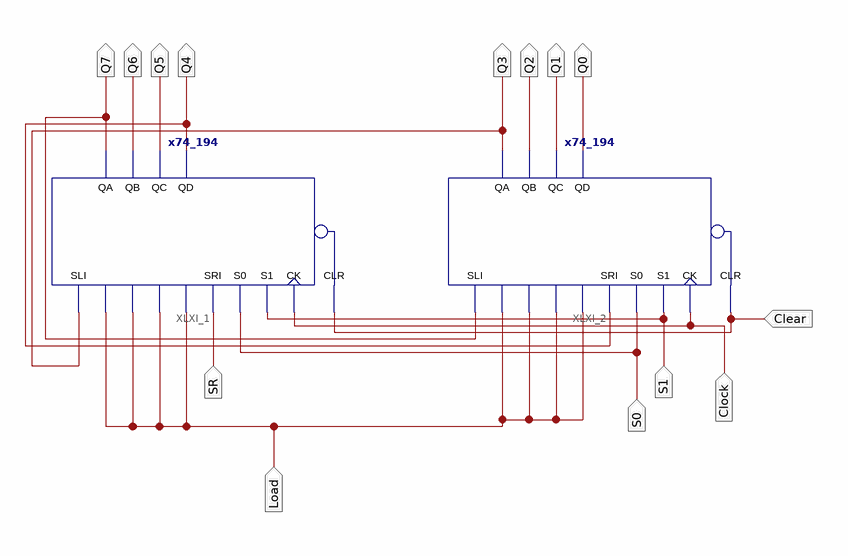
[diagram p0: schematic sheet 1]
// Xilinx ISE schematic lab10_part3_sch.sch (xa9500xl) as structural Verilog: 2 symbols, 14 ports
module lab10_part3_sch (
  input  SR,
  input  S1,
  input  S0,
  input  Clock,
  input  Clear,
  input  Load,
  output Q4,
  output Q3,
  output Q7,
  output Q6,
  output Q5,
  output Q2,
  output Q1,
  output Q0
);

  x74_194 XLXI_1 (
    .A(Load), .B(Load), .C(Load), .CK(Clock), .CLR(Clear), .D(Load), .S0(S0), .S1(S1), .SLI(Q3), .SRI(SR),
    .QA(Q7), .QB(Q6), .QC(Q5), .QD(Q4));
  x74_194 XLXI_2 (
    .A(Load), .B(Load), .C(Load), .CK(Clock), .CLR(Clear), .D(Load), .S0(S0), .S1(S1), .SLI(Q7), .SRI(Q4),
    .QA(Q3), .QB(Q2), .QC(Q1), .QD(Q0));
endmodule
